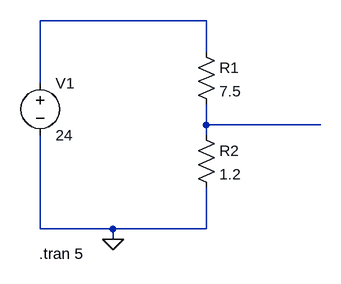
[diagram p0: schematic Draft1.asc]
Draft1.asc, the LTspice schematic file:
Version 4
SHEET 1 880 680
WIRE 160 32 -96 32
WIRE 160 80 160 32
WIRE -96 128 -96 32
WIRE 160 192 160 160
WIRE 336 192 160 192
WIRE 160 208 160 192
WIRE -96 352 -96 208
WIRE 16 352 -96 352
WIRE 160 352 160 288
WIRE 160 352 16 352
WIRE 16 368 16 352
FLAG 16 368 0
SYMBOL res 144 64 R0
SYMATTR InstName R1
SYMATTR Value 7.5
SYMBOL res 144 192 R0
SYMATTR InstName R2
SYMATTR Value 1.2
SYMBOL voltage -96 112 R0
WINDOW 123 0 0 Left 0
WINDOW 39 0 0 Left 0
SYMATTR InstName V1
SYMATTR Value 24
TEXT -98 390 Left 2 !.tran 5

The netlist it stands for:
* Draft1.asc
R1 N001 N002 7.5
R2 N002 0 1.2
V1 N001 0 24
.tran 5
.backanno
.end